# EAGLE schematic FAIO-Switch (EAGLE 7.7.0)
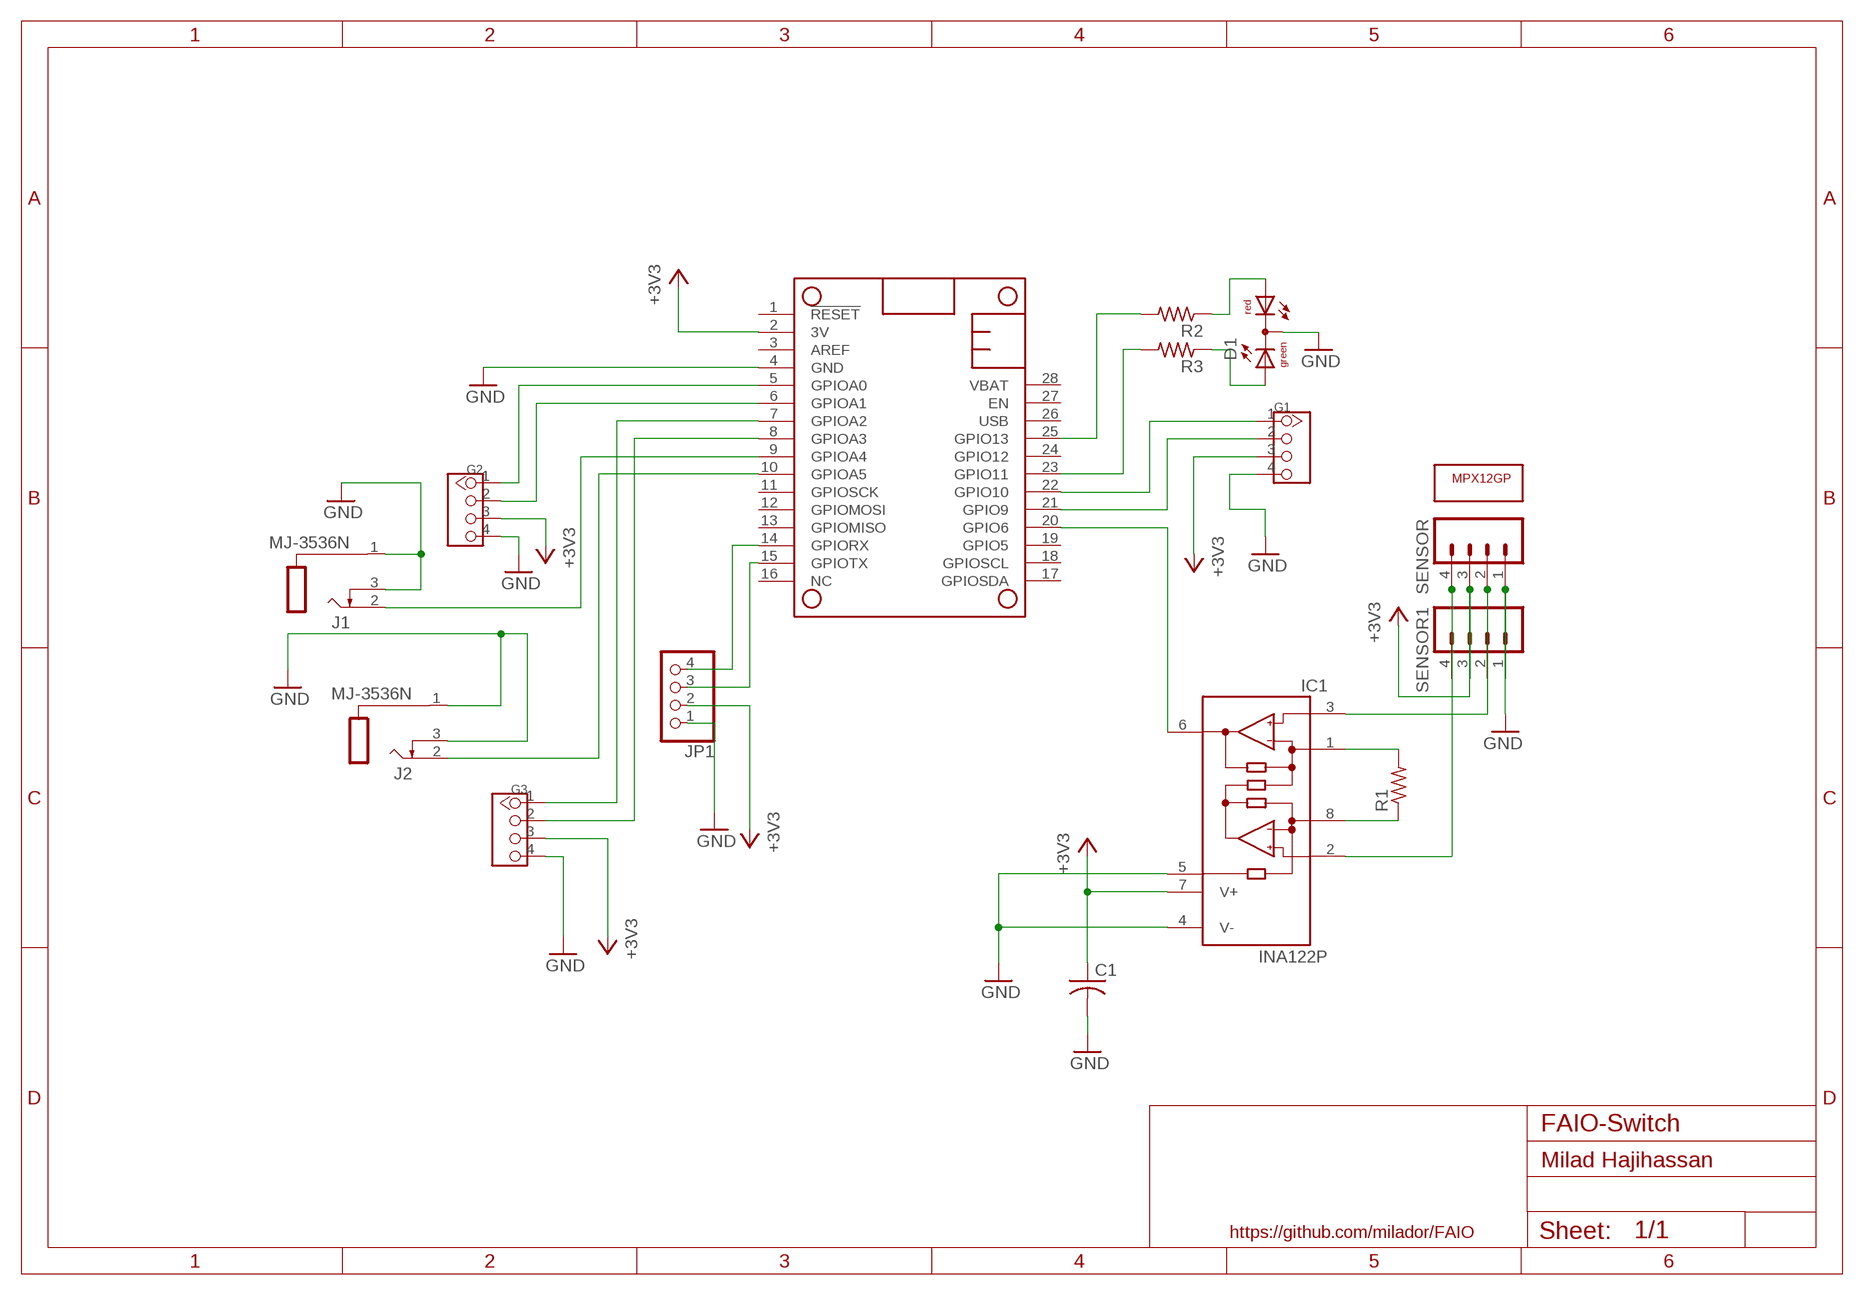
[diagram p0: schematic, sheet 1]

## Parts
C1  C-US025-024X044  [C025-024X044]
D1  DUOLED5MM  [DUOLED5MM]
G1  TWIG-4P-2.0'90D'  [4P-2.0-90D]
G2  TWIG-4P-2.0'90D'  [4P-2.0-90D]
G3  TWIG-4P-2.0'90D'  [4P-2.0-90D]
IC1  INA122P  [DIL08]
J1  MJ-3536N  [MJ-3536N]
J2  MJ-3536N  [MJ-3536N]
JP1  PINHD-1X4  [1X04]
MS1  FEATHERWING_NODIM  [FEATHERWING_DIM]
R1  R-US_0204/7  [0204/7]
R2  R-US_0204/7  [0204/7]
R3  R-US_0204/7  [0204/7]
SENSOR  M04PTH  [1X04]
SENSOR1  M04PTH  [1X04]
U1  MPX12GP  [MPX12GP]

## Nets
+3V3: C1.1 G1.3 G2.3 G3.3 IC1.7(V+) JP1.2 MS1.2(3V) SENSOR1.3 SENSOR.3
GND: C1.2 D1.K(C) G1.4 G2.4 G3.4 IC1.4(V-) IC1.5(REF) J1.1(S) J1.3(TS) J2.1(S) J2.3(TS) JP1.1 MS1.4(GND) SENSOR1.1 SENSOR.1
N$1: IC1.3(+IN) SENSOR1.2 SENSOR.2
N$2: IC1.2(-IN) SENSOR1.4 SENSOR.4
N$3: IC1.1(RG) R1.2
N$4: IC1.8(RG) R1.1
N$5: MS1.25(GPIO13) R2.2
N$6: D1.AR R2.1
N$7: D1.AG R3.1
N$8: MS1.23(GPIO11) R3.2
N$9: IC1.6(OUT) MS1.20(GPIO6)
N$10: JP1.3 MS1.15(GPIOTX)
N$11: J1.2(T) MS1.9(GPIOA4)
N$12: JP1.4 MS1.14(GPIORX)
N$14: G3.1 MS1.7(GPIOA2)
N$15: G1.1 MS1.22(GPIO10)
N$16: J2.2(T) MS1.10(GPIOA5)
N$17: G2.2 MS1.6(GPIOA1)
N$18: G2.1 MS1.5(GPIOA0)
N$19: G1.2 MS1.21(GPIO9)
N$20: G3.2 MS1.8(GPIOA3)
Unconnected: MS1.1(!RESET) MS1.3(AREF) MS1.11(GPIOSCK) MS1.12(GPIOMOSI) MS1.13(GPIOMISO) MS1.16(NC) MS1.17(GPIOSDA) MS1.18(GPIOSCL) MS1.19(GPIO5) MS1.24(GPIO12) MS1.26(USB) MS1.27(EN) MS1.28(VBAT)

## Notes on the sheet
- Milad Hajihassan
- https://github.com/milador/FAIO

## Library data of the parts
C1 = rcl:C-US: CAPACITOR, American symbol
D1 = led:DUOLED5MM: DUO LED 2 colors, 5 mm, round
G1-G3 = Connector:TWIG-4P-2.0
IC1 = burr-brown:INA122: Instrumentation Amplifier Single Supply, MicroPower; MF: TEXAS INSTRUMENTS; MPN: INA122P; OC_FARNELL: 1459460; OC_NEWARK: 15M0948
J1 J2 = con-cuistack:MJ-3536N: Mono Audio Jack, 3.5 MM
JP1 = pinhead:PINHD-1X4: PIN HEADER
MS1 = adafruit:FEATHERWING
R1-R3 = rcl:R-US_: RESISTOR, American symbol
SENSOR SENSOR1 = SparkFun-Connectors:M04: Header 4 Standard 4-pin 0.1" header. Use with straight break away headers (SKU : PRT-00116), right angle break away headers (PRT-00553), swiss pins (PRT-00743), machine pins (PRT-00117), and female headers (PRT-00115). Molex polarized connector foot print use with SKU : PRT-08231 with associated crimp pins and housings. 1MM SMD Version SKU: PRT-10208
U1 = sip-and-puff:MPX12GP